# Altium schematic sheet 2-Charge&Discharge.SchDoc
size A4
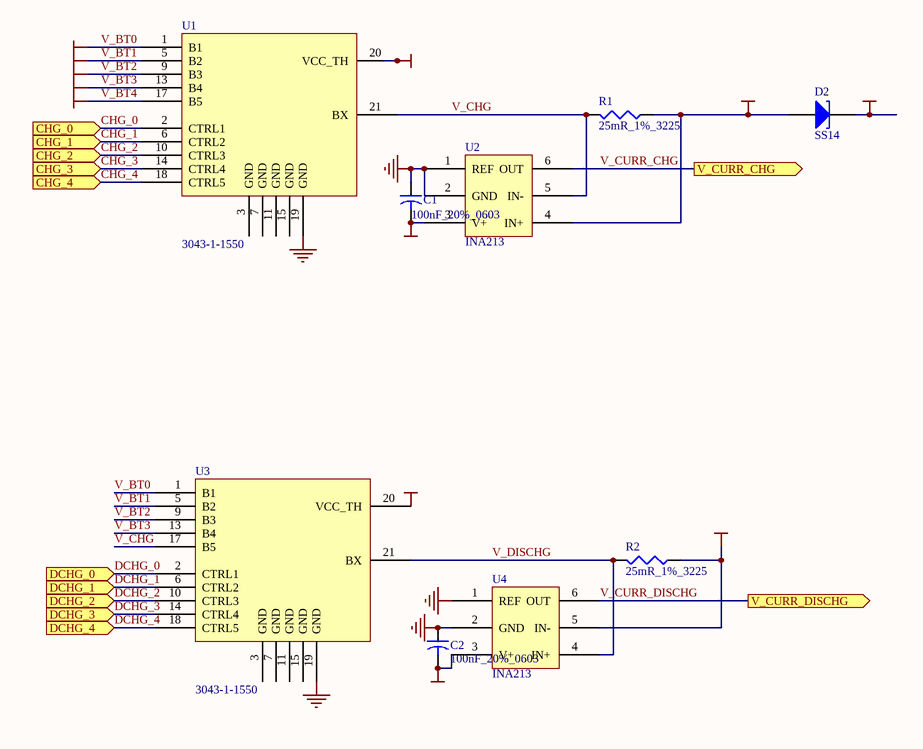
[diagram p0: 2-Charge&Discharge.SchDoc]

## Parts
C1  100nF_20%_0603  [C1608-0603]
C2  100nF_20%_0603  [C1608-0603]
D2  SS14  [DO-214AB_SS14]
R1  25mR_1%_3225  [CC3216-1206]
R2  25mR_1%_3225  [CC3216-1206]
U1  3043-1-1550  [3043-1-1550_V1.10]
U2  INA213  [SC70-6]
U3  3043-1-1550  [3043-1-1550_V1.10]
U4  INA213  [SC70-6]

## Ports
CHG_0 (in), CHG_1 (in), CHG_2 (in), CHG_3 (in), CHG_4 (in), DCHG_0 (in), DCHG_1 (in), DCHG_2 (in), DCHG_3 (in), DCHG_4 (in), V_CURR_CHG (out), V_CURR_DISCHG (out)

## Nets
GND: C1.1 C2.1 U1.19(GND) U2.1(REF) U2.2(GND) U3.19(GND) U4.1(REF) U4.2(GND)
V_BT0: U1.1(B1) U3.1(B1)
V_BT1: U1.5(B2) U3.5(B2)
V_BT2: U1.9(B3) U3.9(B3)
V_BT3: U1.13(B4) U3.13(B4)
V_BT4: D2.2(K) U1.17(B5)
VCC_2V8: C1.2 C2.2 U2.3(V+) U4.3(V+)
VCC_BAT: R2.1 U4.5(IN-)
VCC_CHARGE: D2.1(A) R1.1 U2.4(IN+)
VCC_TH: U1.20(VCC_TH) U3.20(VCC_TH)
CHG_0: U1.2(CTRL1) ; port CHG_0
CHG_1: U1.6(CTRL2) ; port CHG_1
CHG_2: U1.10(CTRL3) ; port CHG_2
CHG_3: U1.14(CTRL4) ; port CHG_3
CHG_4: U1.18(CTRL5) ; port CHG_4
DCHG_0: U3.2(CTRL1) ; port DCHG_0
DCHG_1: U3.6(CTRL2) ; port DCHG_1
DCHG_2: U3.10(CTRL3) ; port DCHG_2
DCHG_3: U3.14(CTRL4) ; port DCHG_3
DCHG_4: U3.18(CTRL5) ; port DCHG_4
V_CHG: R1.2 U1.21(BX) U2.5(IN-) U3.17(B5)
V_CURR_CHG: U2.6(OUT) ; port V_CURR_CHG
V_CURR_DISCHG: U4.6(OUT) ; port V_CURR_DISCHG
V_DISCHG: R2.2 U3.21(BX) U4.4(IN+)

Not connected (* = marked no-connect by the designer): U1 3(GND) 7(GND) 11(GND) 15(GND); U3 3(GND) 7(GND) 11(GND) 15(GND)

## Library data of the parts
C1 C2 = Cap2: Capacitor; Value: 0.1uF 20% 0603; Published: 23-Sep-2002; Publisher: Altium Limited
D2 = D Tunnel1: Tunnel Diode - RLC Model; Published: 8-Jun-2000; LatestRevisionDate: 17-Jul-2002; LatestRevisionNote: Re-released for DXP Platform.; Publisher: Altium Limited
R1 R2 = Res3: Resistor; Value: 150R %5 0603; Published: 8-Jun-2000; Revision: July-2002: Re-released for DXP Platform.; Publisher: Altium Limited